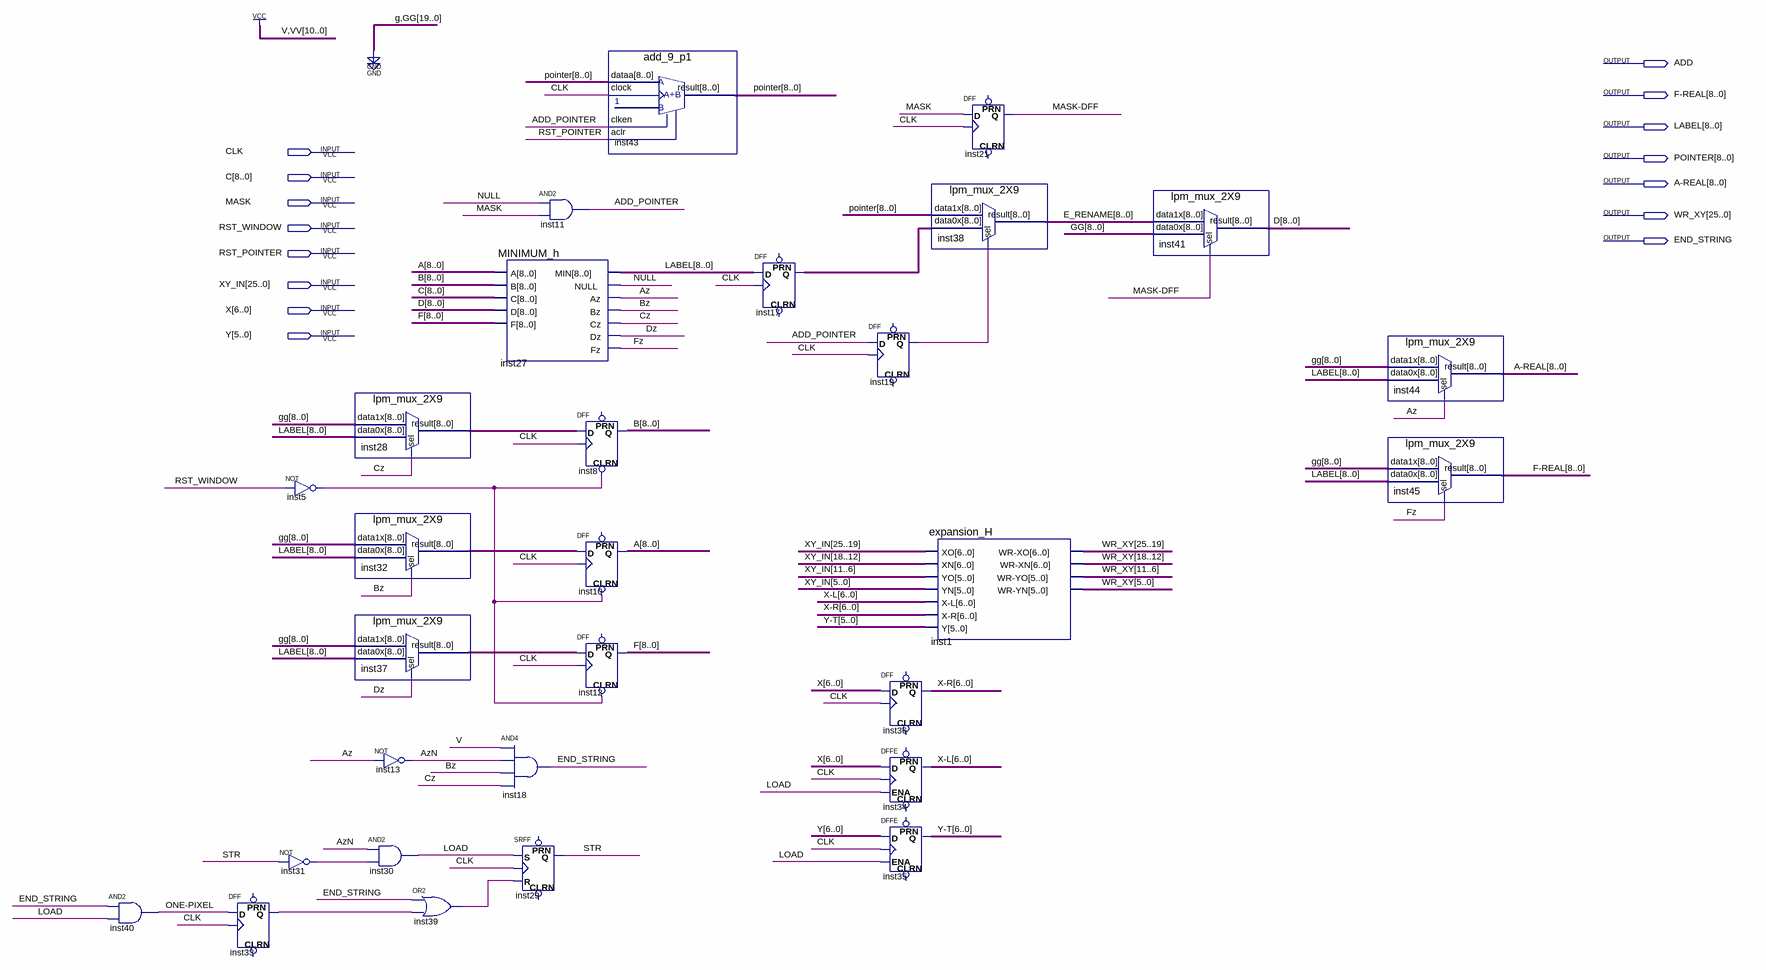
[diagram p0: schematic sheet]
// Quartus schematic WINDOW_H.bdf as structural Verilog: 29 symbols, 15 pins
module WINDOW_H (
  input  CLK,
  input  [8:0] C,
  input  MASK,
  input  RST_WINDOW,
  input  RST_POINTER,
  input  [25:0] XY_IN,
  input  [6:0] X,
  input  [6:0] Y,
  output ADD,
  output [8:0] \F-REAL ,
  output [8:0] LABEL,
  output [8:0] POINTER,
  output [8:0] \A-REAL ,
  output [25:0] WR_XY,
  output END_STRING
);

  wire ADD_POINTER, Az, AzN, Bz, Cz, Dz, Fz, inst5_out, inst19_q, inst31_out, inst33_q, inst39_out, LOAD,
       \MASK-DFF , NULL, \ONE-PIXEL , STR;
  wire [6:0] \X-L , \X-R , \Y-T ;
  wire [8:0] A, B, D, E_RENAME, F, inst17_q, inst28_result, inst32_result, inst37_result;

  and inst40 (\ONE-PIXEL , END_STRING, LOAD);
  DFF inst33 (.CLK(CLK), .D(\ONE-PIXEL ), .Q(inst33_q));  // open: CLRN, PRN
  not inst5 (inst5_out, RST_WINDOW);
  not inst31 (inst31_out, STR);
  lpm_mux_2X9 inst28 (.data1x({9{1'b0}}), .data0x(LABEL), .sel(Cz), .result(inst28_result));
  lpm_mux_2X9 inst32 (.data1x({9{1'b0}}), .data0x(LABEL), .sel(Bz), .result(inst32_result));
  lpm_mux_2X9 inst37 (.data1x({9{1'b0}}), .data0x(LABEL), .sel(Dz), .result(inst37_result));
  not inst13 (AzN, Az);
  and inst30 (LOAD, AzN, inst31_out);
  or inst39 (inst39_out, END_STRING, inst33_q);
  MINIMUM_h inst27 (
    .A(A), .B(B), .C(C), .D(D), .F(F), .MIN(LABEL), .NULL(NULL), .Az(Az), .Bz(Bz), .Cz(Cz), .Dz(Dz), .Fz(Fz));
  and inst18 (END_STRING, 1'b1, AzN, Bz, Cz);
  SRFF inst29 (.S(LOAD), .R(inst39_out), .CLK(CLK), .Q(STR));  // open: PRN, CLRN
  and inst11 (ADD_POINTER, NULL, MASK);
  add_9_p1 inst43 (.dataa(POINTER), .clken(ADD_POINTER), .aclr(RST_POINTER), .clock(CLK), .result(POINTER));
  DFF inst8[8:0] (.CLRN(inst5_out), .CLK(CLK), .D(inst28_result), .Q(B));  // open: PRN
  DFF inst10[8:0] (.CLRN(inst5_out), .CLK(CLK), .D(inst32_result), .Q(A));  // open: PRN
  DFF inst12[8:0] (.CLRN(inst5_out), .CLK(CLK), .D(inst37_result), .Q(F));  // open: PRN
  DFF inst17[8:0] (.CLK(CLK), .D(LABEL), .Q(inst17_q));  // open: CLRN, PRN
  DFF inst19 (.CLK(CLK), .D(ADD_POINTER), .Q(inst19_q));  // open: CLRN, PRN
  DFF inst36[6:0] (.CLK(CLK), .D(X), .Q(\X-R ));  // open: CLRN, PRN
  DFFE inst34[6:0] (.D(X), .CLK(CLK), .ENA(LOAD), .Q(\X-L ));  // open: PRN, CLRN
  DFFE inst35[6:0] (.D(Y), .CLK(CLK), .ENA(LOAD), .Q(\Y-T ));  // open: PRN, CLRN
  DFF inst21 (.CLK(CLK), .D(MASK), .Q(\MASK-DFF ));  // open: CLRN, PRN
  lpm_mux_2X9 inst38 (.data1x(POINTER), .data0x(inst17_q), .sel(inst19_q), .result(E_RENAME));
  expansion_H inst1 (
    .XO(XY_IN[25:19]), .XN(XY_IN[18:12]), .YO(XY_IN[11:6]), .YN(XY_IN[5:0]), .\X-L (\X-L ), .\X-R (\X-R ),
    .Y(\Y-T [5:0]), .\WR-XO (WR_XY[25:19]), .\WR-XN (WR_XY[18:12]), .\WR-YO (WR_XY[11:6]),
    .\WR-YN (WR_XY[5:0]));
  lpm_mux_2X9 inst41 (.data1x(E_RENAME), .data0x({9{1'b0}}), .sel(\MASK-DFF ), .result(D));
  lpm_mux_2X9 inst44 (.data1x({9{1'b0}}), .data0x(LABEL), .sel(Az), .result(\A-REAL ));
  lpm_mux_2X9 inst45 (.data1x({9{1'b0}}), .data0x(LABEL), .sel(Fz), .result(\F-REAL ));
endmodule
